# Altium schematic sheet Voltage Source.SchDoc: Voltage Source
size A3; Author: DODANHLUONG; Revision: 1.0; SheetNumber: 3; SheetTotal: 6; ProjectTitle: DSP_VERSION_1.0
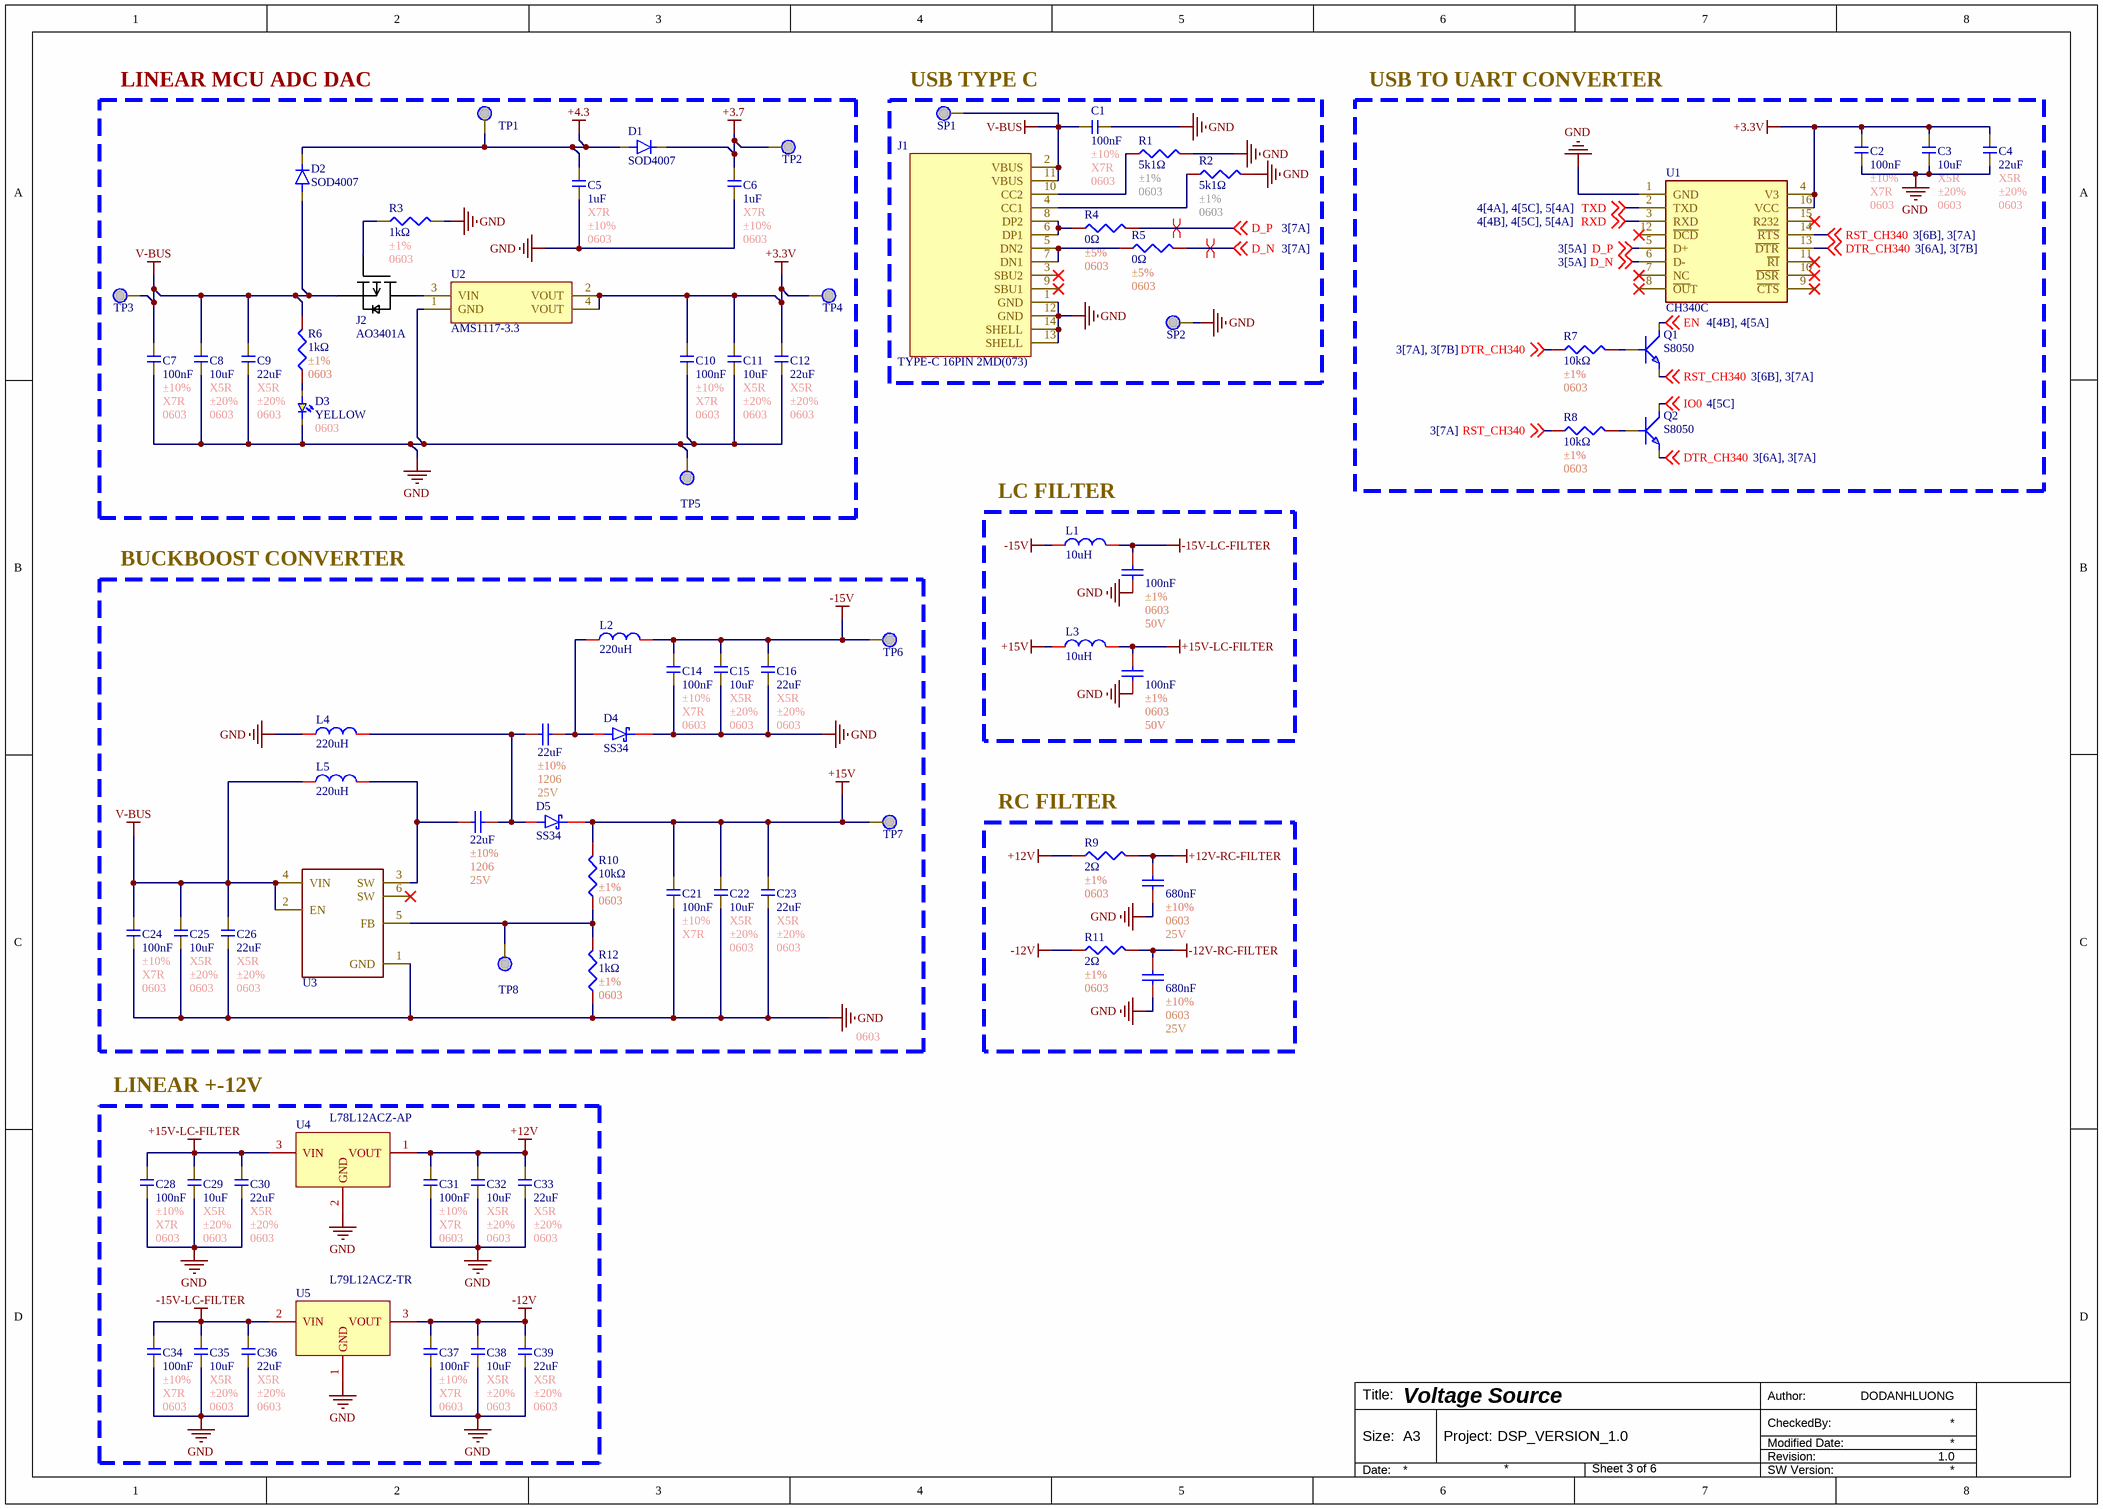
[diagram p0: Voltage Source.SchDoc]

## Parts
C1  100nF  Tolerance: ±10%  Temperature Coefficient: X7R  Package: 0603  [C0603]
C2  100nF  Tolerance: ±10%  Temperature Coefficient: X7R  Package: 0603  [C0603]
C3  10uF  Temperature Coefficient: X5R  Tolerance: ±20%  Package: 0603  [C0603]
C4  22uF  Temperature Coefficient: X5R  Tolerance: ±20%  Package: 0603  [C0603]
C5  1uF  Temperature Coefficient: X7R  Tolerance: ±10%  Package: 0603  [C0603]
C6  1uF  Temperature Coefficient: X7R  Tolerance: ±10%  Package: 0603  [C0603]
C7  100nF  Tolerance: ±10%  Temperature Coefficient: X7R  Package: 0603  [C0603]
C8  10uF  Temperature Coefficient: X5R  Tolerance: ±20%  Package: 0603  [C0603]
C9  22uF  Temperature Coefficient: X5R  Tolerance: ±20%  Package: 0603  [C0603]
C10  100nF  Tolerance: ±10%  Temperature Coefficient: X7R  Package: 0603  [C0603]
C11  10uF  Temperature Coefficient: X5R  Tolerance: ±20%  Package: 0603  [C0603]
C12  22uF  Temperature Coefficient: X5R  Tolerance: ±20%  Package: 0603  [C0603]
C13  100nF  Tolerance: ±1%  Package: 0603  Voltage Rating: 50V  [C0603]
C14  100nF  Tolerance: ±10%  Temperature Coefficient: X7R  Package: 0603  [C0603]
C15  10uF  Temperature Coefficient: X5R  Tolerance: ±20%  Package: 0603  [C0603]
C16  22uF  Temperature Coefficient: X5R  Tolerance: ±20%  Package: 0603  [C0603]
C17  100nF  Tolerance: ±1%  Package: 0603  Voltage Rating: 50V  [C0603]
C18  22uF  Tolerance: ±10%  Package: 1206  Voltage Rating: 25V  [C1206]
C19  22uF  Tolerance: ±10%  Package: 1206  Voltage Rating: 25V  [C1206]
C20  680nF  Tolerance: ±10%  Package: 0603  Voltage Rating: 25V  [C0603]
C21  100nF  Tolerance: ±10%  Temperature Coefficient: X7R  Package: 0603  [C0603]
C22  10uF  Temperature Coefficient: X5R  Tolerance: ±20%  Package: 0603  [C0603]
C23  22uF  Temperature Coefficient: X5R  Tolerance: ±20%  Package: 0603  [C0603]
C24  100nF  Tolerance: ±10%  Temperature Coefficient: X7R  Package: 0603  [C0603]
C25  10uF  Temperature Coefficient: X5R  Tolerance: ±20%  Package: 0603  [C0603]
C26  22uF  Temperature Coefficient: X5R  Tolerance: ±20%  Package: 0603  [C0603]
C27  680nF  Tolerance: ±10%  Package: 0603  Voltage Rating: 25V  [C0603]
C28  100nF  Tolerance: ±10%  Temperature Coefficient: X7R  Package: 0603  [C0603]
C29  10uF  Temperature Coefficient: X5R  Tolerance: ±20%  Package: 0603  [C0603]
C30  22uF  Temperature Coefficient: X5R  Tolerance: ±20%  Package: 0603  [C0603]
C31  100nF  Tolerance: ±10%  Temperature Coefficient: X7R  Package: 0603  [C0603]
C32  10uF  Temperature Coefficient: X5R  Tolerance: ±20%  Package: 0603  [C0603]
C33  22uF  Temperature Coefficient: X5R  Tolerance: ±20%  Package: 0603  [C0603]
C34  100nF  Tolerance: ±10%  Temperature Coefficient: X7R  Package: 0603  [C0603]
C35  10uF  Temperature Coefficient: X5R  Tolerance: ±20%  Package: 0603  [C0603]
C36  22uF  Temperature Coefficient: X5R  Tolerance: ±20%  Package: 0603  [C0603]
C37  100nF  Tolerance: ±10%  Temperature Coefficient: X7R  Package: 0603  [C0603]
C38  10uF  Temperature Coefficient: X5R  Tolerance: ±20%  Package: 0603  [C0603]
C39  22uF  Temperature Coefficient: X5R  Tolerance: ±20%  Package: 0603  [C0603]
D1  SOD4007  [SOD4007]
D2  SOD4007  [SOD4007]
D3  YELLOW  Package: 0603  [LED0603]
D4  SS34  [SS34]
D5  SS34  [SS34]
J1  TYPE-C 16PIN 2MD(073)  [TYPE_C_FAMALE]
J2  AO3401A  [AO3401A]
L1  10uH  [CD43]
L2  220uH  [CD43]
L3  10uH  [CD43]
L4  220uH  [CD43]
L5  220uH  [CD43]
Q1  S8050  [S8050]
Q2  S8050  [S8050]
R1  5k1Ω  Tolerance: ±1%  Package: 0603  [R0603]
R2  5k1Ω  Tolerance: ±1%  Package: 0603  [R0603]
R3  1kΩ  Tolerance: ±1%  Package: 0603  [R0603]
R4  0Ω  Tolerance: ±5%  Package: 0603  [R0603]
R5  0Ω  Tolerance: ±5%  Package: 0603  [R0603]
R6  1kΩ  Tolerance: ±1%  Package: 0603  [R0603]
R7  10kΩ  Tolerance: ±1%  Package: 0603  [R0603]
R8  10kΩ  Tolerance: ±1%  Package: 0603  [R0603]
R9  2Ω  Tolerance: ±1%  Package: 0603  [R0603]
R10  10kΩ  Tolerance: ±1%  Package: 0603  [R0603]
R11  2Ω  Tolerance: ±1%  Package: 0603  [R0603]
R12  1kΩ  Tolerance: ±1%  Package: 0603  [R0603]
SP1  SP  [SP]  (value not drawn)
SP2  SP  [SP]  (value not drawn)
TP1  TP  [TP]  (value not drawn)
TP2  TP  [TP]  (value not drawn)
TP3  TP  [TP]  (value not drawn)
TP4  TP  [TP]  (value not drawn)
TP5  TP  [TP]  (value not drawn)
TP6  TP  [TP]  (value not drawn)
TP7  TP  [TP]  (value not drawn)
TP8  TP  [TP]  (value not drawn)
U1  CH340C  [CH340C]
U2  AMS1117-3.3  [AMS1117-3.3]
U3  XL6009  [XL6009]  (value not drawn)
U4  L78L12ACZ-AP  [L78L12ACZ-AP]
U5  L79L12ACZ-TR  [L79L12ACZ-TR]

## Blocks framed on the sheet
LINEAR MCU ADC DAC: C5-C12 D1-D3 J2 R3 R6 TP1-TP5 U2
USB TYPE C: C1 J1 R1 R2 R4 R5 SP1 SP2
USB TO UART CONVERTER: C2-C4 Q1 Q2 R7 R8 U1
LC FILTER: C13 C17 L1 L3
BUCKBOOST CONVERTER: C14-C16 C18 C19 C21-C26 D4 D5 L2 L4 L5 R10 R12 TP6-TP8 U3
RC FILTER: C20 C27 R9 R11
LINEAR +-12V: C28-C39 U4 U5

## Nets
+3.3V: C2.2 C3.2 C4.2 C10.2 C11.2 C12.2 TP4.1 U1.4(V3) U1.16(VCC) U2.2(VOUT) U2.4(VOUT)
+3.7: C6.2 D1.1(C) TP2.1
+4.3: C5.2 D1.2(A) D2.1(C) TP1.1
+12V: C31.2 C32.2 C33.2 R9.1 U4.1(VOUT)
+12V-RC-FILTER: C20.1 R9.2
+15V: C21.2 C22.2 C23.2 D5.1 L3.1 R10.2 TP7.1
+15V-LC-FILTER: C17.1 C28.2 C29.2 C30.2 L3.2 U4.3(VIN)
-12V: C37.2 C38.2 C39.2 R11.1 U5.3(VOUT)
-12V-RC-FILTER: C27.1 R11.2
-15V: C14.2 C15.2 C16.2 L1.1 L2.2 TP6.1
-15V-LC-FILTER: C13.1 C34.2 C35.2 C36.2 L1.2 U5.2(VIN)
GND: C1.1 C2.1 C3.1 C4.1 C5.1 C6.1 C7.1 C8.1 C9.1 C10.1 C11.1 C12.1 C13.2 C14.1 C15.1 C16.1 C17.2 C20.2 C21.1 C22.1 C23.1 C24.1 C25.1 C26.1 C27.2 C28.1 C29.1 C30.1 C31.1 C32.1 C33.1 C34.1 C35.1 C36.1 C37.1 C38.1 C39.1 D3.1 D4.1 J1.1(GND) J1.12(GND) J1.13(SHELL) J1.14(SHELL) L4.1 R1.2 R2.2 R3.2 R12.1 SP2.1 TP5.1 U1.1(GND) U2.1(GND) U3.1(GND) U4.2(GND) U5.1(GND)
V-BUS: C1.2 C7.2 C8.2 C9.2 C24.2 C25.2 C26.2 D2.2(A) J1.2(VBUS) J1.11(VBUS) J2.2(S) L5.1 R6.2 SP1.1 TP3.1 U3.2(EN) U3.4(VIN)
D_N: R5.2 U1.6(D-) ; off-sheet D_N
D_P: R4.2 U1.5(D+) ; off-sheet D_P
DTR_CH340: Q2.2(E) R7.1 U1.13(~{DTR}) ; off-sheet DTR_CH340
EN: Q1.3(C) ; off-sheet EN
IO0: Q2.3(C) ; off-sheet IO0
RST_CH340: Q1.2(E) R8.1 U1.14(~{RTS}) ; off-sheet RST_CH340
RXD: U1.3(RXD) ; off-sheet RXD
TXD: U1.2(TXD) ; off-sheet TXD
NetC18_1: C18.1 D4.2 L2.1
NetC18_2: C18.2 C19.1 D5.2 L4.2
NetC19_2: C19.2 L5.2 U3.3(SW)
NetD3_2: D3.2 R6.1
NetJ1_4: J1.4(CC1) R2.1
NetJ1_5: J1.5(DN2) J1.7(DN1) R5.1
NetJ1_6: J1.6(DP1) J1.8(DP2) R4.1
NetJ1_10: J1.10(CC2) R1.1
NetJ2_1: J2.1(G) R3.1
NetJ2_3: J2.3(D) U2.3(VIN)
NetQ1_1: Q1.1(B) R7.2
NetQ2_1: Q2.1(B) R8.2
NetR10_1: R10.1 R12.2 TP8.1 U3.5(FB)

Not connected (* = marked no-connect by the designer): J1 3(SBU2)* 9(SBU1)*; U1 7(NC)* 8(~{OU}T)* 9(~{CTS})* 10(~{DSR})* 11(~{RI})* 12(~{DCD})* 15(R232)*; U3 6(SW)*

## Layout directives
differential pair: D_N, D_P

## Notes on the sheet
- Author:
- Title:
- Size:
- A3
- Project:
- Revision:
- Modified Date:
- CheckedBy:
- Date:
- SW Version:

## Library data of the parts
C1 C2 C7 C10 C14 C21 C24 C28 C31 C34 C37 = C0603_100nF_±10%_X7R: 50V 100nF X7R ±10% 0603 Multilayer Ceramic Capacitors MLCC - SMD/SMT ROHS; Manufacturer: YAGEO; Mfr. Part #: CC0603KRX7R9BB104; LCSC Part #: C14663; Capacitance: 100nF; Link: https://www.lcsc.com/product-detail/C14663.html?s_z=n_capital%25200603%2520100nf
C3 C8 C11 C15 C22 C25 C29 C32 C35 C38 = C0603_10uF_±10%_X7R: 25V 10uF X5R ±20% 0603 Multilayer Ceramic Capacitors MLCC - SMD/SMT ROHS; Manufacturer: YAGEO; Mfr. Part #: CC0603MRX5R8BB106; LCSC Part #: C596327; Capacitance: 10uF; Link: https://www.lcsc.com/product-detail/C596327.html?s_z=n_capital%25200603%252010uF%2520yageo
C4 C9 C12 C16 C23 C26 C30 C33 C36 C39 = C0603_22uF_±20%_X5R: 6.3V 22uF X5R ±20% 0603 Multilayer Ceramic Capacitors MLCC - SMD/SMT ROHS; Manufacturer: YAGEO; Mfr. Part #: CC0603MRX5R5BB226; LCSC Part #: C109448; ComponentLink1Description: New link; ComponentLink1URL: *; Capacitance: 22uF; Link: https://www.lcsc.com/product-detail/C109448.html?s_z=n_capital%25200603%252022uf%2520yageo
C5 C6 = C0603_1uF_±10%_X7R: 50V 1uF X7R ±10% 0603 Multilayer Ceramic Capacitors MLCC - SMD/SMT ROHS; Manufacturer: YAGEO; Mfr. Part #: CC0603KRX7R9BB105; LCSC Part #: C559769; Capacitance: 1uF; Link: https://www.lcsc.com/product-detail/C559769.html?s_z=n_capital%25200603%25201uF%2520yageo
C13 C17 = C0603_100nF_±1%: 50V 10pF NP0 ±1% 0402 Multilayer Ceramic Capacitors MLCC - SMD/SMT ROHS; Manufacturer: YAGEO; Mfr. Part #: CC0402FRNPO9BN100; LCSC Part #: C513681; Link: https://www.lcsc.com/product-detail/C513681.html?s_z=n_capital%2520yageo%252010pF%25200402; Capacitance: 100nF
C18 C19 = C1206_22uF_±1%: 25V 22uF X5R ±10% 1206 Multilayer Ceramic Capacitors MLCC - SMD/SMT ROHS; Manufacturer: YAGEO; Mfr. Part #: CC1206KKX5R8BB226; LCSC Part #: C2178233; Link: https://www.lcsc.com/product-detail/C2178233.html?s_z=n_capital%25201206%252022uf%2520yageo; Capacitance: 22uF
C20 C27 = C0603_680nF_±1%: 25V 680nF X5R ±10% 0603 Multilayer Ceramic Capacitors MLCC - SMD/SMT ROHS; Manufacturer: YAGEO; Mfr. Part #: CC0603KRX5R8BB684; LCSC Part #: C327005; Link: https://www.lcsc.com/product-detail/C327005.html?s_z=n_capital%2520yageo%2520680%2520nF%25200603; Capacitance: 680nF
D1 D2 = SOD4007: 1A Independent 1kV 1.1V@1A SOD-123FL Diodes - General Purpose ROHS; Manufacturer: MDD(Microdiode Semiconductor); Mfr. Part #: SOD4007; Package: SOD-123FL; LCSC Part #: C18124; Link: https://www.lcsc.com/product-detail/C18124.html?s_z=n_SOD4007; Voltage - DC Reverse(Vr): 1kV; Current - Rectified: 1A
D3 = D0603_YELLOW: 25mcd~40mcd Water Clear -40℃~+85℃ 624nm Red 120° 60mW 0402 LED Indication - Discrete ROHS; Manufacturer: XINGLIGHT; Mfr. Part #: XL-1005UGC; Voltage - Forward(Vf): 3V; LCSC Part #: C965793; Power(Watts): 60mW; Link: https://www.lcsc.com/product-detail/C136765.html?s_z=n_LED%25200402%2520RED; Illumination Color: YELLOW
D4 D5 = SS34: 40V Independent 3A 550mV@3A SMA(DO-214AC) Schottky Diodes ROHS; Manufacturer: MDD(Microdiode Semiconductor); Mfr. Part #: SS34; LCSC Part #: C8678; Package: SMA(DO-214AC); Voltage - DC Reverse(Vr): 40V; Current - Rectified: 3A; Link: https://www.lcsc.com/product-detail/C8678.html?s_z=n_SS34
J1 = TYPE_C_FAMALE_16PIN: 3A 1 Surface Mount, Right Angle 16P Female -25℃~+85℃ Type-C SMD USB Connectors ROHS; Manufacturer: SHOU HAN; Mfr. Part #: TYPE-C 16PIN 2MD(073); LCSC Part #: C2765186; Package: SMD; Number of Contacts: 16P; Link: https://www.lcsc.com/product-detail/C2765186.html?s_z=n_type%2520c
J2 = AO3401: 30V 4A 900mV@250uA 1 P-Channel SOT-23 MOSFETs ROHS; Manufacturer: AOS; Mfr. Part #: AO3401A; LCSC Part #: C15127; Package: SOT-23; Current - Continuous Drain(Id): 4A; Drain to Source Voltage: 30V; Link: https://www.lcsc.com/product-detail/C15127.html?s_z=n_AO3401
L1 L3 = CD4-10UH: 1.15A 10uH Unshielded Inductor ±20% SMD,4x4.5mm Power Inductors ROHS; Manufacturer: ZE; Mfr. Part #: CD43-100M; Key Attributes: FIXED IND 10uH 1.15A 182mΩ SMD,4x4.5mm; DC Resistance(DCR): 182mΩ; LCSC Part #: C18734467; Package: SMD,4x4.5mm; Link: https://www.lcsc.com/product-detail/C18734467.html?s_z=n_CD43%252010uH; Tolerance: ±20%; Current Rating: 1.15A; Inductance: 10uH
L2 L4 L5 = CD4-220UH: 360mA 220uH ±20% SMD,4.5x4x3.2mm Power Inductors ROHS; Manufacturer: YJYCOIN; Mfr. Part #: CD43YP0403-221M; Key Attributes: FIXED IND 220uH 360mA 3.4Ω SMD,4.5x4x3.2mm; DC Resistance(DCR): 3.4Ω; LCSC Part #: C492283; Package: SMD,4.5x4x3.2mm; Link: https://www.lcsc.com/product-detail/C492283.html?s_z=n_220uH%2520cd43; Tolerance: ±20%; Current Rating: 360mA; Inductance: 220uH
Q1 Q2 = S8050: 25V 300mW 500mA SOT-23 Bipolar (BJT) ROHS; Manufacturer: JSMSEMI; Key Attributes: TRANS 25V 500mA SOT-23; Transition frequency(fT): 150MHz; Vce Saturation(VCE(sat)): 600mV; Mfr. Part #: S8050; LCSC Part #: C916390; Package: SOT-23; Link: https://www.lcsc.com/product-detail/C916390.html?s_z=n_s8050; Current - Collector(Ic): 500mA
R1 R2 = R0603_5k1Ω_±1%: 100mW Thick Film Resistor 75V ±100ppm/℃ ±1% 5.1kΩ 0603 Chip Resistor - Surface Mount ROHS; Manufacturer: FOJAN; Mfr. Part #: FRC0603F5101TS; Key Attributes: RES 5.1kΩ ±1% 100mW 0603; LCSC Part #: C2907044; Link: https://www.lcsc.com/product-detail/C2907044.html?s_z=n_5k1%25200603; Resistance: 5k1Ω
R3 = R0603_1kΩ_±1%: 100mW Thick Film Resistor 75V ±100ppm/℃ ±1% 1kΩ 0603 Chip Resistor - Surface Mount ROHS; Manufacturer: YAGEO; Mfr. Part #: RC0603FR-071KL; Key Attributes: RES 1kΩ ±1% 100mW 0603; LCSC Part #: C22548; Link: https://www.lcsc.com/product-detail/C22548.html?s_z=n_resistor%25200603%25201k%2520yageo; Resistance: 1kΩ
R4 R5 = R0603_0Ω_±5%: 100mW Thick Film Resistor 75V ±5% 0Ω 0603 Chip Resistor - Surface Mount ROHS; Manufacturer: YAGEO; Mfr. Part #: RC0603JR-070RL; Key Attributes: RES 0Ω ±5% 100mW 0603; LCSC Part #: C95177; Resistance: 0Ω; Link: https://www.lcsc.com/product-detail/C138066.html?s_z=n_resistor%25200402%252010R
R6 R12 = R0603_1kΩ_±1%: 62.5mW Thick Film Resistor 50V ±1% ±200ppm/℃ 10Ω 0402 Chip Resistor - Surface Mount ROHS; Manufacturer: YAGEO; Mfr. Part #: RC0402FR-0710RL; LCSC Part #: C138066; Resistance: 1kΩ; Link: https://www.lcsc.com/product-detail/C138066.html?s_z=n_resistor%25200402%252010R
R7 R8 R10 = R0603_10kΩ_±1%: 62.5mW Thick Film Resistor 50V ±1% ±200ppm/℃ 10Ω 0402 Chip Resistor - Surface Mount ROHS; Manufacturer: YAGEO; Mfr. Part #: RC0402FR-0710RL; LCSC Part #: C138066; Resistance: 10kΩ; Link: https://www.lcsc.com/product-detail/C138066.html?s_z=n_resistor%25200402%252010R
R9 R11 = R0603_2Ω_±5%: 100mW Thick Film Resistor 75V ±1% ±200ppm/℃ 2Ω 0603 Chip Resistor - Surface Mount ROHS; Manufacturer: YAGEO; Mfr. Part #: RC0603FR-072RL; Key Attributes: RES 0Ω ±5% 100mW 0603; LCSC Part #: C185341; Resistance: 2Ω; Link: https://www.lcsc.com/product-detail/C185341.html?s_z=n_resistor%2520yageo%25202%25CE%25A9%25200603
U1 = CH340C: 2Mbps Transceiver USB 2.0 SOP-16 USB Converters ROHS; Manufacturer: WCH; Voltage - Supply: 3.3V;5V; LCSC Part #: C84681; Package: SOP-16; Link: https://www.lcsc.com/product-detail/C84681.html?s_z=n_CH340C; Mfr. Part #: CH340C
U2 = AMS1117-3.3: 72dB@(120Hz) 1A Fixed 3.3V Positive 16V SOT-223 Voltage Regulators - Linear, Low Drop Out (LDO) Regulators ROHS; Manufacturer: Advanced Monolithic Systems; LCSC Part #: C6186; Link: https://www.lcsc.com/product-detail/C6186.html?s_z=n_ams1117-3.3; Output Current: 1A; Package: SOT-223; Mfr. Part #: AMS1117-3.3
U4 = L7812CV-DG: 42dB@(120Hz) 100mA Fixed 12V Positive 35V TO-92-3 Voltage Regulators - Linear, Low Drop Out (LDO) Regulators ROHS; Parameter 1: ST; Key Attributes: 0.1A Positive Voltage Regulator; Number of Outputs: 1; Voltage Dropout: 1.7V; Mfr. Part #: L78L12ACZ-AP; LCSC Part #: C262913; Package: TO-92-3; Voltage - Supply: 35V; Output Voltage: 12V; Output Configuration: Positive; Link: https://www.lcsc.com/product-detail/C262913.html?s_z=n_78L12
U5 = L79L12ACZ-TR: 37dB@(120Hz) 100mA Fixed 12V Negative 27V TO-92-3 Voltage Regulators - Linear, Low Drop Out (LDO) Regulators ROHS; Parameter 1: ST; Key Attributes: Negative Voltage Regulator; Number of Outputs: 1; Voltage Dropout: 1.7V; Output Configuration: Positive; Mfr. Part #: L79L12ACZ-TR; LCSC Part #: C2942984; Package: TO-92-3; Voltage - Supply: 27V; Output Voltage: 12V; Link: https://www.lcsc.com/product-detail/C2942984.html?s_z=n_79L12